# EAGLE design Akpinar_Lixie_Versorgung (EAGLE 7.7.0)
PROJEKT_NAME: Lixie-Uhr; REVISION: V01; SCH_SHEET_NAME: Buck-Converter; TITLE: Lixie-Uhr-Versorgung; USER_NAME: Akpinar Eren
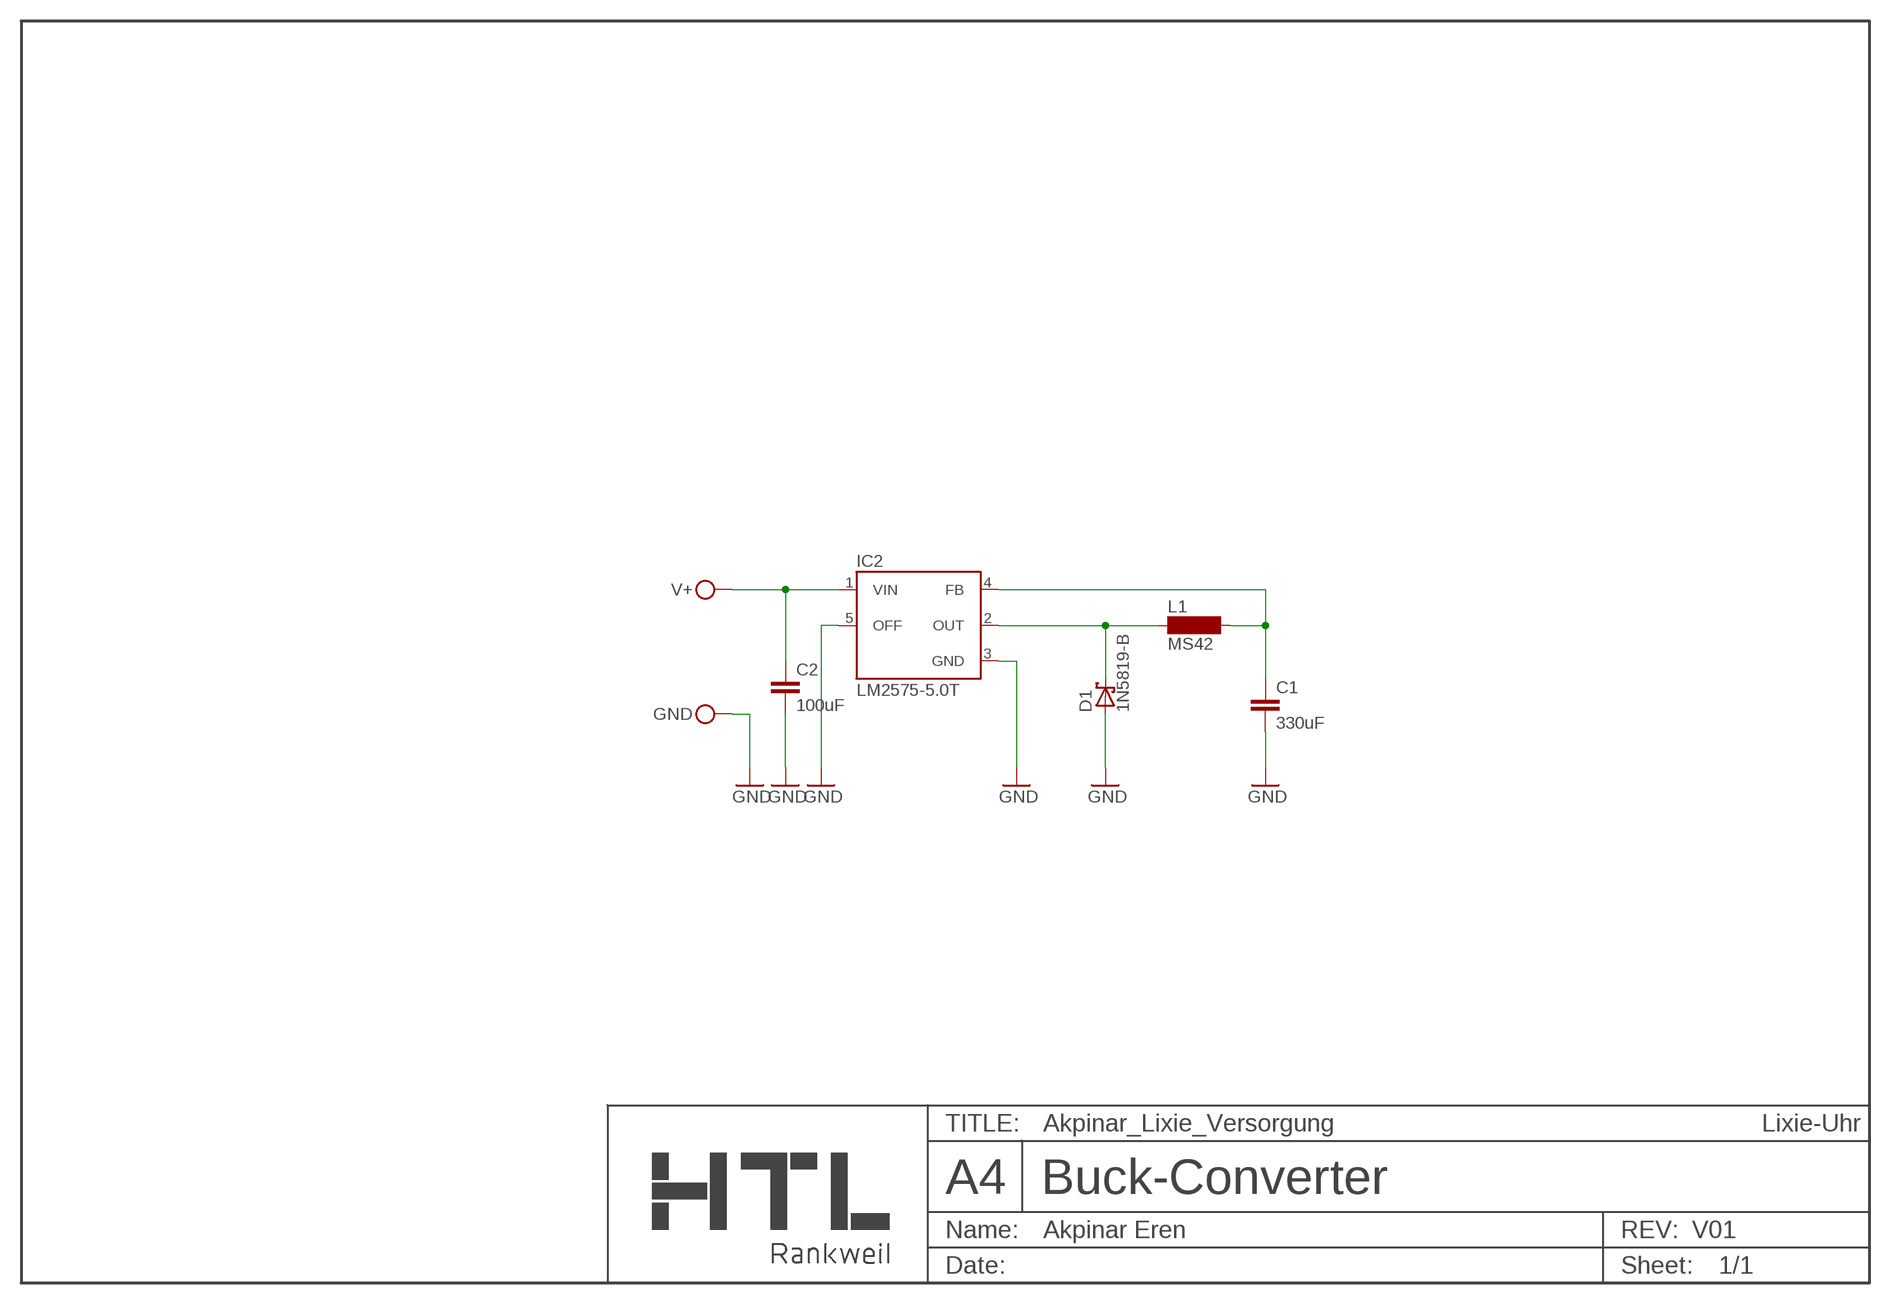
[diagram p0: schematic, sheet 1]

## Parts
C1  330uF  C-1206  [C1206]
C2  100uF  C-1206  [C1206]
D1  1N5819-B  [DO41-7.6]
FRAME1  HTL-A4-HA4H  [HTL-A4-H]
GND  LPIN  [LPIN]
IC2  LM2575-5.0T  [TO220-5]
L1  MS42  [MS42]
V+  LPIN  [LPIN]

## Nets
GND: C1.2 C2.2 D1.A GND.P$1(KL) IC2.3(GND) IC2.5(OFF)
N$1: D1.C IC2.2(OUT) L1.1
N$2: C1.1 IC2.4(FB) L1.2
V+: C2.1 IC2.1(VIN) V+.P$1(KL)

## Library data of the parts
C1 C2 = 0_HTL_MegaCard_V3:C: Capacitor
D1 = diode:1N581*: 1.0A SCHOTTKY BARRIER RECTIFIER Source: http://www.diodes.com/datasheets/ds23001.pdf
FRAME1 = 0_HTL_frame:HTL-A4-H: Arbeitsblatt der HTL Rankweil für Schaltpläne DIN-A4 Landscape kombinierbar mit Boardplänen (CHANGE PACKAGE): DIN-A3 Landscape DIN-A3 Portrait DIN-A4 Landscape DIN-A4 Portrait Leer (für Projekte mit mehreren Schaltplänen und einem Board) Über Attribute werden die Beschriftungeinträge gesteuert: Attribut USER_NAME ( Schaltplan + Board) PROJEKT_NAME ( Schaltplan + Board) ACCOUNT_NAME ( Schaltplan + Board) REVISION ( Schaltplan + Board) SCH_SHEET_NAME ( Schaltplan) BRD_SHEET_NAME ( Board)
GND V+ = 0_HTL_elektro:LPIN: Lötstift
IC2 = lm2575:LM2575-5.0: National Semiconductor <http://www.national.com> 1.0A "Simple Switcher"(c) 52kHz, Vout 1.23-37V (HV: 57V), Vin 40V (HV: 60V), 50µA standby current
L1 = inductor-neosid:MS42: INDUCTOR SMD inductor; OC_FARNELL: unknown; OC_NEWARK: unknown

## Board
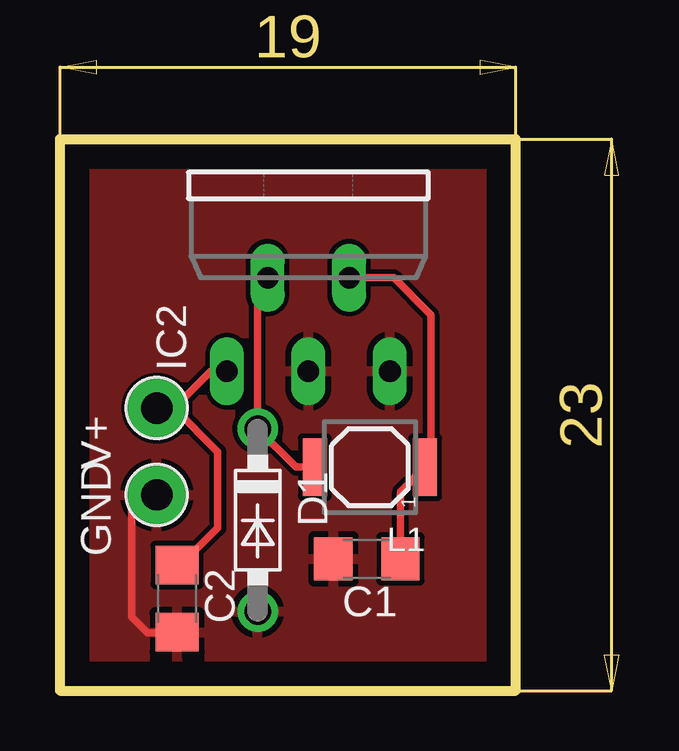
[diagram p1: board, top side]

Size 19 x 23 mm. Coordinates in mm from the lower left corner, seen from the top.
Outline: 0,0 19,0 19,23 0,23 0,0
Copper layers (1*16): Top 0.035mm / dielectric 1.5mm / Bottom 0.035mm
Design rules "default": minimum track width 10mil, minimum drill 24mil, track to track 8mil, track to pad 8mil, pad to pad 8mil, via to via 8mil, smd to smd 8mil, copper to edge 40mil, drill to drill 8mil, minimum pad ring 10mil, minimum via ring 8mil, stop-mask expansion 4mil, vias tented up to drill 0mil, thermal gap 10mil

### Footprints (pad centres in the part's own frame; a part is rotated, then mirrored left to right if it is on the bottom)
C1206 = smd 1.6 x 1.8: 1 -1.4,0; 2 1.4,0
DO41-7.6 = drill 1.1 pad 1.7: A 3.81,0; C -3.81,0
LPIN = drill 1.3 pad 2.54: P$1 0,0
TO220-5 = drill 0.9 long: 1 -3.4,-8.4; 2 -1.7,-4.5; 3 0,-8.4; 4 1.7,-4.5; 5 3.4,-8.4
MS42 = smd 2.4 x 1: 1 0,2.3; 2 0,-2.3

### Placement (x,y rotation side)
C1  12.8,5.5 180 top
C2  4.89,3.84 270 top
D1  8.25,7.11 270 top
FRAME1  -121.92,-87.63 0 top  (outside the outline)
GND  4.04,8.16 90 top
IC2  10.36,21.72 0 top
L1  12.93,9.32 90 top
V+  4.04,11.78 90 top

### Tracks (layer width: path | path; a pad name or v marks a point on that pad's centre or on a via)
GND
  Top 0.305: GND.P$1 3.69,8.16 3,7.47 3,3.07 3.66,2.41 4.86,2.41 C2.2
  pour Top: 0.58,22.23 18.07,22.21 18.17,0.67 0.69,0.7
N$1
  Top 0.254: 8.67,17.17 IC2.2
  Top 0.305: L1.1 9.85,9.32 D1.C 8.25,16.81 IC2.2
N$2
  Top 0.305: IC2.4 13.92,17.22 15.47,15.67 15.47,9.56 L1.2 14.2,8.29 C1.1
V+
  Top 0.305: V+.P$1 4.75,11.78 | 4.75,11.78 6.58,9.96 6.58,6.78 5.31,5.51 5.16,5.51 C2.1 | IC2.1 6.29,13.32 4.75,11.78